# Altium schematic sheet USR_IO_IPMI.SchDoc: IPMI
size 420 x 297 mm; Author: G.K.; CompanyName: WUT; DrawnBy: G.K.; Organization: CERN; Address1: Warsaw Univeristy of Technology; Address2: Nowowiejska 15/19; DocumentNumber: 6; Revision: -; SheetNumber: 6; SheetTotal: -; EDA_Number: ARTIQ; Projet: RTM 4SFP 3QSFP; ModifiedBy: -; CreateDate: XX/XX/XXXX; CheckedDate: -; Title2: and thermometers; DivGrp: ISE; Designer: G.K.; ModifiedDate: -; ProjectName: RTM 4SFP 3QSFP
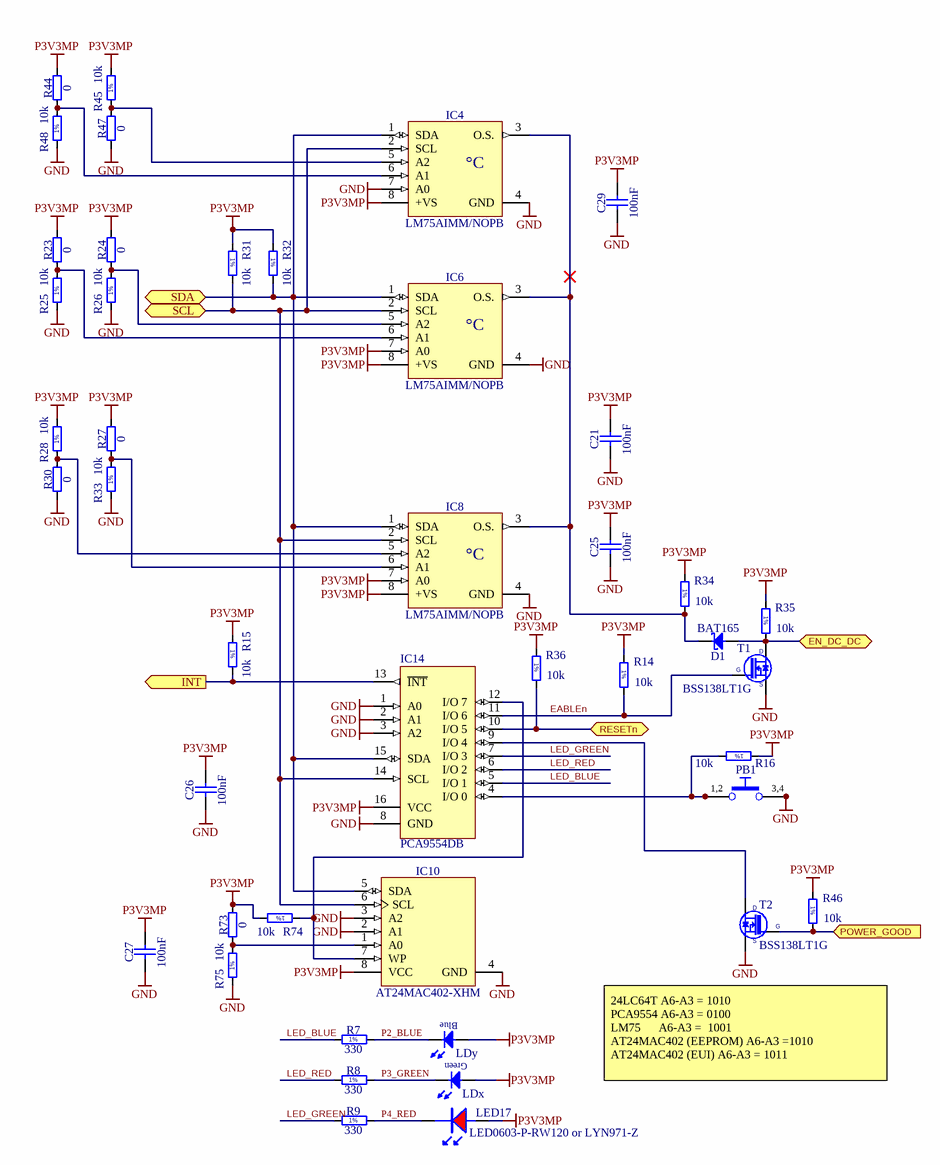
[diagram p0: USR_IO_IPMI.SchDoc]

## Parts
C21  100nF  [CAPC1005X55N]
C25  100nF  [CAPC1005X55N]
C26  100nF  [CAPC1005X55N]
C27  100nF  [CAPC1005X55N]
C29  100nF  [CAPC1005X55N]
D1  BAT165  [SOD2512X110N]
IC4  LM75AIMM/NOPB  [SOP65P490X109-8N]
IC6  LM75AIMM/NOPB  [SOP65P490X109-8N]
IC8  LM75AIMM/NOPB  [SOP65P490X109-8N]
IC10  AT24MAC402-XHM  [SOP65P640X120-8N]
IC14  PCA9554DB  [SOP65P640X120-16N]
LDx  Green  [LED_AVAGO_HSME-C120rev]  (value not drawn)
LDy  Blue  [LED_AVAGO_HSME-C120rev]  (value not drawn)
LED17  LED0603-P-RW120 or LYN971-Z  [led_0603R]
PB1  Push Button  [SW_C&K_HDT0001]  (value not drawn)
R7  330  [RESC1608X55N]
R8  330  [RESC1608X55N]
R9  330  [RESC1608X55N]
R14  10k  [RESC1005X40N]
R15  10k  [RESC1005X40N]
R16  10k  [RESC1005X40N]
R23  0  [RESC1608X55N]
R24  0  [RESC1608X55N]
R25  10k  [RESC1005X40N]
R26  10k  [RESC1005X40N]
R27  0  [RESC1608X55N]
R28  10k  [RESC1005X40N]
R30  0  [RESC1608X55N]
R31  10k  [RESC1005X40N]
R32  10k  [RESC1005X40N]
R33  10k  [RESC1005X40N]
R34  10k  [RESC1005X40N]
R35  10k  [RESC1005X40N]
R36  10k  [RESC1005X40N]
R44  0  [RESC1608X55N]
R45  10k  [RESC1005X40N]
R46  10k  [RESC1005X40N]
R47  0  [RESC1608X55N]
R48  10k  [RESC1005X40N]
R73  0  [RESC1608X55N]
R74  10k  [RESC1005X40N]
R75  10k  [RESC1005X40N]
T1  BSS138LT1G  [SOT95P240X110-3N]
T2  BSS138LT1G  [SOT95P240X110-3N]

## Ports
EN_DC_DC (bidir), INT (out), POWER_GOOD (in), RESETn (bidir), SCL (bidir), SDA (bidir)

## Nets
GND: C21.2 C25.2 C26.2 C27.2 C29.2 IC4.4(GND) IC4.7(A0) IC6.4(GND) IC8.4(GND) IC10.2(A1) IC10.3(A2) IC10.4(GND) IC14.1(A0) IC14.2(A1) IC14.3(A2) IC14.8(GND) PB1.3 PB1.4 R25.1 R26.1 R30.1 R33.1 R47.1 R48.1 R75.1 T1.2(S) T2.2(S)
P3V3MP: C21.1 C25.1 C26.1 C27.1 C29.1 IC4.8(+VS) IC6.7(A0) IC6.8(+VS) IC8.7(A0) IC8.8(+VS) IC10.8(VCC) IC14.16(VCC) LDx.1(A) LDy.1(A) LED17.A R14.1 R15.1 R16.1 R23.2 R24.2 R27.2 R28.2 R31.1 R32.1 R34.1 R35.1 R36.1 R44.2 R45.2 R46.1 R73.2 R74.2
EABLEn: IC14.11(I/O_6) R14.2 T1.1(G)
EN_DC_DC: D1.2(A) R35.2 T1.3(D) ; port EN_DC_DC
INT: IC14.13(~{INT}) R15.2 ; port INT
LED_BLUE: IC14.5(I/O_1) R7.1
LED_GREEN: IC14.7(I/O_3) R9.1
LED_RED: IC14.6(I/O_2) R8.1
P2_BLUE: LDy.2(C) R7.2
P3_GREEN: LDx.2(C) R8.2
P4_RED: LED17.K R9.2
POWER_GOOD: R46.2 T2.1(G) ; port POWER_GOOD
RESETn: IC14.10(I/O_5) R36.2 ; port RESETn
SCL: IC4.2(SCL) IC6.2(SCL) IC8.2(SCL) IC10.6(SCL) IC14.14(SCL) R31.2 ; port SCL
SDA: IC4.1(SDA) IC6.1(SDA) IC8.1(SDA) IC10.5(SDA) IC14.15(SDA) R32.2 ; port SDA
NetD1_1: D1.1(C) IC4.3(O.S.) IC6.3(O.S.) IC8.3(O.S.) R34.2
NetIC4_5: IC4.5(A2) R45.1 R47.2
NetIC4_6: IC4.6(A1) R44.1 R48.2
NetIC6_5: IC6.5(A2) R24.1 R26.2
NetIC6_6: IC6.6(A1) R23.1 R25.2
NetIC8_5: IC8.5(A2) R28.1 R30.2
NetIC8_6: IC8.6(A1) R27.1 R33.2
NetIC10_1: IC10.1(A0) R73.1 R75.2
NetIC10_7: IC10.7(WP) IC14.12(I/O_7) R74.1
NetIC14_4: IC14.4(I/O_0) PB1.1 PB1.2 R16.2
NetIC14_9: IC14.9(I/O_4) T2.3(D)

## Notes on the sheet
- 24LC64T A6-A3 = 1010
  PCA9554 A6-A3 = 0100
  LM75      A6-A3 =  1001
  AT24MAC402 (EEPROM) A6-A3 =1010
  AT24MAC402 (EUI) A6-A3 = 1011
- Project/Equipment
- Document
- Designer
- Drawn by
- Check.by
- Copyright WUT ISE 2018.
  This documentation describes Open Hardware and is licensed under the CERN OHL v.1.1. You may redistribute and modify this documentation under the terms of the CERN OHL v.1.1. (http://ohwr.org/CERNOHL). This documentation is distributed WITHOUT ANY EXPRESS OR IMPLIED WARRANTY, INCLUDING OF MERCHANTABILITY, SATISFACTORY QUALITY AND FITNESS FOR A PARTICULAR PURPOSE. Please see the CERN OHL v.1.1 for applicable conditions.
- Contact
- File
- Last Mod.
- Print Date
- Sheet
- Size
- A3
- of
- Rev
- (in symbol LM75AIMM/NOPB) °C
- (in symbol R0402_10K_1%_0.0625W_100PPM) 1%
- (in symbol R0603_330R_1%_0.1W_100PPM) 1%
- (in symbol SW_C&K_HDT0001) 1,2; 3,4

## Library data of the parts
C21 C25-C27 C29 = CC0402_100NF_16V_10%_X7R: Non-polarised capacitor; Part Description: SMD Multilayer Chip Ceramic Capacitor; Manufacturer: GENERIC; Manufacturer1 Part Number: 223878715649; Voltage: 16V; TC: X7R; Tolerance: ±10%; Table: Capacitors SMD; Part Number: CC0402_100NF_16V_10%_X7R; Component Kind: Standard; Component Type: Standard; Pin Count: 2; Value: 100nF; Status: Not Recommended; Manufacturer Part Number: CC0402_100NF_16V_10%_X7R; Case: 0402; Mounted: Yes; Socket: No; SMD: Yes; Manufacturer1 Example: PHYCOMP; Manufacturer1 ComponentHeight: 0.55mm; HelpURL: \\cern.ch\dfs\Applications\Altium\Datasheets\CC0402_X7R_PHYCOMP.pdf; Author: CERN DEM JLC; CreateDate: 12/3/2007; LatestRevisionDate: 12/3/2007
D1 = BAT165: Schottky Diode; Manufacturer: INFINEON; Part Description: Medium Power AF Schottky Diode; Voltage: 40V; Power: 750mA; PressFit: No; Bonding: No; Manufacturer Part Number: BAT165; PackageDescription: Small Outline Diode (SOD-323), 1.70mm W X 1.25mm L X 1.10mm H body,  IPC Medium Density; Part Number: BAT165; Component Kind: Standard; Component Type: Standard; Device: BAT165; Pin Count: 2; Case: SOD323; Mounted: Yes; Socket: No; SMD: Yes; Sense: No; ComponentHeight: 1.1mm; HelpURL: \\cern.ch\dfs\Applications\Altium\Datasheets\BAT165.pdf; Author: CERN DEM JLC; CreateDate: 12.11.2014; LatestRevisionDate: 12.11.2014
IC4 IC6 IC8 = LM75AIMM/NOPB: Digital Temperature Sensor and Thermal Watchdog with Two-Wire Interface; Manufacturer: TEXAS INSTRUMENTS; Part Description: -25° to +100°C ±2°C Digital Temperature Sensor and Thermal Watchdog with Two-Wire Interface; PressFit: No; Bonding: No; Manufacturer Part Number: LM75AIMM/NOPB; PackageDescription: SOP, 0.65mm pitch; 8 pin,3.00mm W X 3.00mm L X 1.09mm H bodyI, PC Medium Density; Part Number: LM75AIMM/NOPB; Component Kind: Standard; Component Type: Standard; Device: LM75AIMM/NOPB; Pin Count: 8; Case: SSOP8; Mounted: Yes; Socket: No; SMD: Yes; Sense: No; ComponentHeight: 1.09mm; HelpURL: \\cern.ch\dfs\Applications\Altium\Datasheets\LM75AIMM-NOPB.pdf; Author: CERN DEM JLC; CreateDate: 15.10.2012; LatestRevisionDate: 15.10.2012
IC10 = AT24MAC402-XHM: 1.7V to 5.5V, I2C-Compatible (2-wire) 2-Kbit (256 x 8) Serial EEPROM; Manufacturer: ATMEL; Part Description: 1.7V to 5.5V, I2C-Compatible (2-wire) 2-Kbit (256 x 8) Serial EEPROM with a EUI-48 Address; PressFit: No; Bonding: No; Footprint: SOP65X640X120-8N; Manufacturer Part Number: AT24MAC402-XHM; PackageDescription: SOP, 0.65mm pitch; 8 pin, 4.40mm W X 3.00mm L X 1.20mm H body, IPC Medium Density; Part Number: AT24MAC402-XHM; Component Kind: Standard; Component Type: Standard; Device: AT24MAC402-XHM; Pin Count: 8; Case: TSSOP8; Mounted: Yes; Socket: No; SMD: Yes; Sense: No; ComponentHeight: 1.2mm; HelpURL: \\cern.ch\dfs\Applications\Altium\Datasheets\AT24MAC402-XHM.pdf; Author: CERN DEM MR; CreateDate: 09.03.2016; LatestRevisionDate: 09.11.2016
IC14 = PCA9554D: 8-bit I2C-bus SMBus I/O port with interrupt; Manufacturer1 PN: PCA9554D,112; Manufacturer1: NXP Semiconductors; Distributor1: Digikey; Distributor1 PN: 568-1053-5-ND
LDx = LED_SMD_90deg_mini_G: LED Green Avago C120; Part Number: LED_AVAGO_HSME-C120; Part Description: High Performance Right Angle Chip Green LED; Manufacturer: AVAGO TECHNOLOGIES; Manufacturer Part Number: HSME-C120; Table: LEDs & Displays; Component Kind: Standard; Component Type: Standard; Color: Green; Footprint: LED_AVAGO_HSME-C120; PackageDescription: Green Chip LED, 2-Leads, Body 1.7x1.1mm, Side Emitting Package; Pin Count: 2; Mounted: Yes; Socket: No; SMD: Yes; ComponentHeight: 0.7mm; HelpURL: \\cern.ch\dfs\Applications\Altium\Datasheets\LED_AVAGO_HSME-C120.pdf; ComponentLink1URL: \\cern.ch\dfs\Applications\Altium\Datasheets\LED_AVAGO_HSME-C110_DESIGN-GUIDE.pdf; ComponentLink1Description: Design Guide; Author: CERN DEM JMW; CreateDate: 2009-07-22; LatestRevisionDate: 2012-06-20
LDy = LED_SMD_90deg_mini_B: LED Blue Avago C120; Part Number: LED_AVAGO_HSMR-C120; Part Description: High Performance Right Angle Chip Blue LED; Manufacturer: AVAGO TECHNOLOGIES; Manufacturer Part Number: HSMR-C120; Table: LEDs & Displays; Component Kind: Standard; Component Type: Standard; Color: Blue; Footprint: LED_AVAGO_HSMR-C120; PackageDescription: Blue Chip LED, 2-Leads, Body 1.7x1.1mm, Side Emitting Package; Pin Count: 2; Mounted: Yes; Socket: No; SMD: Yes; ComponentHeight: 0.7mm; HelpURL: \\cern.ch\dfs\Applications\Altium\Datasheets\LED_AVAGO_HSME-C120.pdf; ComponentLink1URL: \\cern.ch\dfs\Applications\Altium\Datasheets\LED_AVAGO_HSME-C110_DESIGN-GUIDE.pdf; ComponentLink1Description: Design Guide; Author: CERN DEM JMW; CreateDate: 2009-07-22; LatestRevisionDate: 2012-06-20
LED17 = LED_0603R: LED 0603 red; Supplier 1: Newark; Supplier Part Number 1: 22M3004; Supplier 2: Newark; Supplier Part Number 2: 20M0618
PB1 = SW_C&K_HDT0001: Push-Button Switch SPDT; Part Description: 5VDC 1mA SPST-NO Micro Mini Surface Surface Mount Detect Push-Button Switch, HDT Serie; Manufacturer: C&K; Table: Switches; Part Number: SW_C&K_HDT0001; Component Kind: Standard; Component Type: Standard; Pin Count: 4; PackageDescription: Body 3.5x2.8mm, Micro Mini Surface Mount Detect Switches, HDT Serie; Family: Push Button; Mounted: Yes; Socket: No; SMD: Yes; Status: None; Manufacturer Part Number: HDT0001; ComponentHeight: 3.35mm; HelpURL: \\cern.ch\dfs\Applications\Altium\Datasheets\SW_C&K_HDT0001.pdf; Author: CERN DEM JLC; CreateDate: 2012-08-15; LatestRevisionDate: 2012-08-15
R7-R9 = R0603_330R_1%_0.1W_100PPM: Resistor - 1%; Part Description: General Purpose Thick Film Chip Resistor; Manufacturer: GENERIC; Manufacturer1 Part Number: NRC06F3300TRF; Power: 0.1W; TC: ±100ppm/°C; Table: Resistors SMD; Part Number: R0603_330R_1%_0.1W_100PPM; Component Kind: Standard; Component Type: Standard; Pin Count: 2; Value: 330; Status: Preferred; Tolerance: ±1%; Manufacturer Part Number: R0603_330R_1%_0.1W_100PPM; Case: 0603; Mounted: Yes; Socket: No; SMD: Yes; Manufacturer1 Example: NIC COMPONENT; Manufacturer1 ComponentHeight: 0.55mm; HelpURL: \\cern.ch\dfs\Applications\Altium\Datasheets\R0603_NIC_NRC.pdf; Author: CERN DEM JLC; CreateDate: 2007-12-03; LatestRevisionDate: 2008-03-13
R14-R16 R25 R26 R28 R31-R36 R45 R46 R48 R74 R75 = R0402_10K_1%_0.0625W_100PPM: Resistor - 1%; Part Description: General Purpose Thick Film Chip Resistor; Manufacturer: GENERIC; Manufacturer1 Part Number: 232270671003L; TC: ±100ppm/°C; Table: Resistors SMD; Part Number: R0402_10K_1%_0.0625W_100PPM; Component Kind: Standard; Component Type: Standard; Pin Count: 2; Value: 10k; Status: Not recommended; Power: 0.0625W; Tolerance: ±1%; Manufacturer Part Number: R0402_10K_1%_0.0625W_100PPM; Case: 0402; Mounted: Yes; Socket: No; SMD: Yes; Manufacturer1 Example: YAGEO PHYCOMP; Manufacturer1 ComponentHeight: 0.4mm; HelpURL: \\cern.ch\dfs\Applications\Altium\Datasheets\R0402_Phycomp_RC0402.pdf; Author: CERN DEM JLC; CreateDate: 2007-12-03; LatestRevisionDate: 2012-10-17
R23 R24 R27 R30 R44 R47 R73 = R0603_0R_JUMPER: Resistor; Part Description: 1A (0.05R Max DC Resistance) Zero Ohm Jumper; Manufacturer: GENERIC; Manufacturer1 Part Number: NRC06Z0; PressFit: No; Part Number: R0603_0R_JUMPER; Component Kind: Standard; Component Type: Standard; Pin Count: 2; Value: 0; Status: Preferred; Manufacturer Part Number: R0603_0R_JUMPER; Case: 0603; Mounted: Yes; Sense: No; Socket: No; SMD: Yes; Manufacturer1 Example: NIC COMPONENT; Manufacturer1 ComponentHeight: 0.55mm; HelpURL: \\cern.ch\dfs\Applications\Altium\Datasheets\R0603_NIC_NRC.pdf; Author: CERN DEM JLC; CreateDate: 03.12.2007; LatestRevisionDate: 13.03.2008
T1 T2 = BSS138LT1G: N-CHANNEL MOSFET WITH DIODE; Part Description: 50V 200mA N-Channel Enhancement Mode Field-Effect Transistor; Manufacturer: ON SEMICONDUCTOR; PressFit: No; Bonding: No; Part Number: BSS138LT1G; Component Kind: Standard; Component Type: Standard; Device: BSS138LT1G; PackageDescription: SOT23 3-Leads, Pitch 0.95mm - Body 1.4x3mm, IPC Medium Density; Manufacturer Part Number: BSS138LT1G; Pin Count: 3; Case: SOT23-3; Mounted: Yes; Socket: No; SMD: Yes; Sense: No; ComponentHeight: 1.11mm; HelpURL: \\cern.ch\dfs\Applications\Altium\Datasheets\BSS138LT1G.pdf; Author: CERN DEM JLC; CreateDate: 23.03.2009; LatestRevisionDate: 23.03.2009